# Altium schematic sheet Rectification filter.SchDoc
size A4
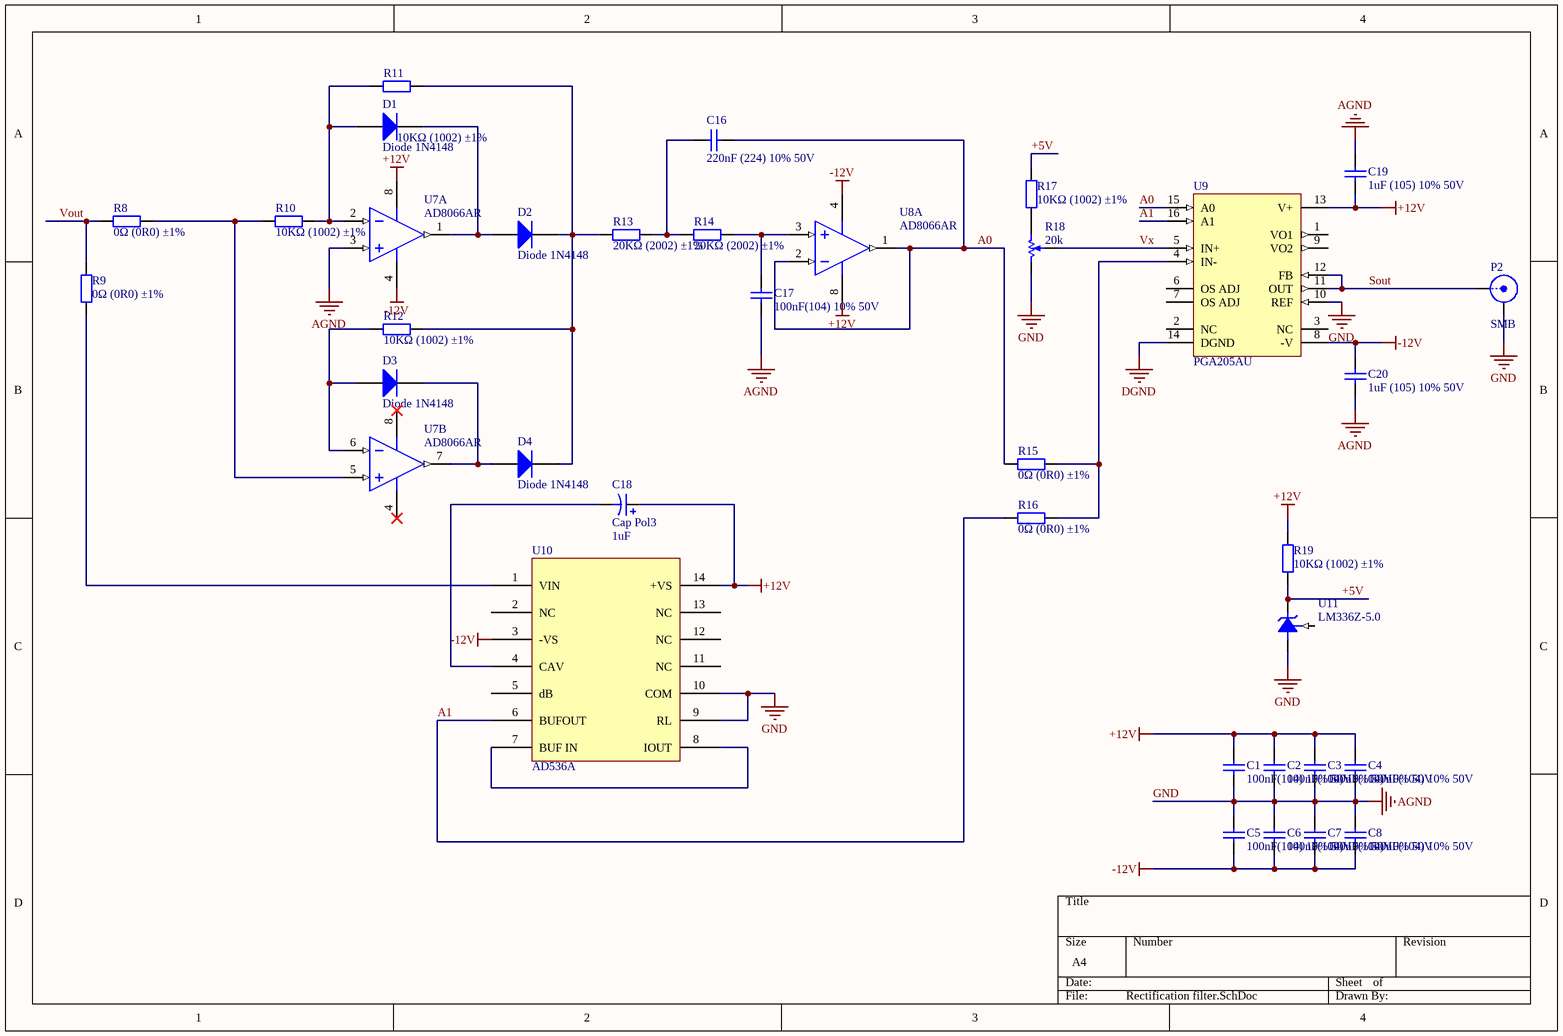
[diagram p0: Rectification filter.SchDoc]

## Parts
20k  R18  [POT4MM-2]
C1  100nF(104) 10% 50V  [LC-0805_C]
C2  100nF(104) 10% 50V  [LC-0805_C]
C3  100nF(104) 10% 50V  [LC-0805_C]
C4  100nF(104) 10% 50V  [LC-0805_C]
C5  100nF(104) 10% 50V  [LC-0805_C]
C6  100nF(104) 10% 50V  [LC-0805_C]
C7  100nF(104) 10% 50V  [LC-0805_C]
C8  100nF(104) 10% 50V  [LC-0805_C]
C16  220nF (224) 10% 50V  [LC-0805_C]
C17  100nF(104) 10% 50V  [LC-0805_C]
C18  Cap Pol3  value 1uF  [C0805]
C19  1uF (105) 10% 50V  [LC-0805_C]
C20  1uF (105) 10% 50V  [LC-0805_C]
D1  Diode 1N4148  [DO-35]
D2  Diode 1N4148  [DO-35]
D3  Diode 1N4148  [DO-35]
D4  Diode 1N4148  [DO-35]
P2  SMB  [SMB_V-RJ45]
R8  0Ω (0R0) ±1%  [LC-0805_R]
R9  0Ω (0R0) ±1%  [LC-0805_R]
R10  10KΩ (1002) ±1%  [LC-0805_R]
R11  10KΩ (1002) ±1%  [LC-0805_R]
R12  10KΩ (1002) ±1%  [LC-0805_R]
R13  20KΩ (2002) ±1%  [LC-0805_R]
R14  20KΩ (2002) ±1%  [LC-0805_R]
R15  0Ω (0R0) ±1%  [LC-0805_R]
R16  0Ω (0R0) ±1%  [LC-0805_R]
R17  10KΩ (1002) ±1%  [LC-0805_R]
R19  10KΩ (1002) ±1%  [LC-0805_R]
U7  AD8066AR  [ADI-R-8_N]  (parts A,B of 2)
U8  AD8066AR  [ADI-R-8_N]  (part A of 2)
U9  PGA205AU  [211F_N]
U10  AD536A
U11  LM336Z-5.0  [Z03A]

## Nets
+12V: C1.2 C2.2 C3.2 C4.2 C18.1 C19.1 R19.2 U7.8(+VS) U8.8(+VS) U9.13(V+) U10.14(+VS)
-12V: C5.1 C6.1 C7.1 C8.1 C20.2 U7.4(-VS) U8.4(-VS) U9.8(-V) U10.3(-VS)
DGND: U9.14(DGND)
GND: 20k.CW(+) C1.1 C2.1 C3.1 C4.1 C5.2 C6.2 C7.2 C8.2 C17.1 C19.2 C20.1 P2.2(Y) U7.3(+IN_1) U9.10(REF) U10.9(RL) U10.10(COM) U11.3(-V)  [also labelled AGND]
+5V: R17.2 R19.1 U11.2(+V)
A0: C16.2 R15.1 U8.1(VOUT_1) U8.2(-IN_1) U9.15(A0)
A1: R16.1 U9.16(A1) U10.6(BUFOUT)
Sout: P2.1(X) U9.11(OUT) U9.12(FB)
Vout: R8.1 R9.2
Vx: 20k.W U9.5(IN+)
Net20k_CCW: 20k.CCW(-) R17.1
NetC16_1: C16.1 R13.2 R14.1
NetC17_2: C17.2 R14.2 U8.3(+IN_1)
NetC18_2: C18.2 U10.4(CAV)
NetD1_1: D1.1(A) R10.2 R11.1 U7.2(-IN_1)
NetD1_2: D1.2(K) D2.1(A) U7.1(VOUT_1)
NetD2_2: D2.2(K) D4.2(K) R11.2 R12.2 R13.1
NetD3_1: D3.1(A) R12.1 U7.6(-IN_2)
NetD3_2: D3.2(K) D4.1(A) U7.7(VOUT_2)
NetR8_2: R8.2 R10.1 U7.5(+IN_2)
NetR9_1: R9.1 U10.1(VIN)
NetR15_2: R15.2 R16.2 U9.4(IN-)
NetU10_7: U10.7(BUF_IN) U10.8(IOUT)

Not connected (* = marked no-connect by the designer): U9 1(VO1) 2(NC) 3(NC) 6(OS_ADJ) 7(OS_ADJ) 9(VO2); U10 2(NC) 5(dB) 11(NC) 12(NC) 13(NC); U11 1(ADJ)

## Library data of the parts
20k = RPot SM: Square Trimming Potentiometer; Published: 17-Dec-2003; DatasheetVersion: Oct-2003; PackageReference: POT4MM-2; Publisher: Altium Limited; PackageDescription: Square Trimming Potentiometer; ComponentLink1Description: Manufacturer Link; ComponentLink1URL: http://bourns.com/2/search.html
C1-C8 C17 = 0805 100nF(104) 10% 50V: 贴片电容; ComponentLink1Description: 供应商链接; ComponentLink1URL: http://www.szlcsc.com/product/details_50686.html; Package: 0805; Supplier: LC; SuppliersPartNumber: C49678
C16 = 0805 220nF (224) 10% 50V: 贴片电容; ComponentLink1Description: 供应商链接; ComponentLink1URL: http://www.szlcsc.com/product/details_5810.html; Package: 0805; Supplier: LC; SuppliersPartNumber: C5378
C18 = Cap Pol3: Polarized Capacitor (Surface Mount); Published: 8-Jun-2000; LatestRevisionDate: 29-May-2009; LatestRevisionNote: IPC-7351 Footprint Added.; PackageReference: C0805; Publisher: Altium Limited; PackageDescription: Chip Capacitor
C19 C20 = 0805 1uF (105) 10% 50V: 贴片电容; ComponentLink1Description: 供应商链接; ComponentLink1URL: http://www.szlcsc.com/product/details_29074.html; Package: 0805; Supplier: LC; SuppliersPartNumber: C28323
D1-D4 = Diode 1N4148: High Conductance Fast Diode; Published: 8-Jun-2000; LatestRevisionDate: 17-Jul-2002; LatestRevisionNote: Re-released for DXP Platform.; DatasheetVersion: 1997; PackageReference: DO-35; Publisher: Altium Limited; PackageDescription: Diode, Axial; Body 3.8 x 1.9 mm (LxDia. max), Lead Dia. 0.53 mm (max); Code_JEDEC: DO-204-AH; ComponentLink1Description: Manufacturer Link; ComponentLink1URL: http://www.fairchildsemi.com/; ComponentLink2Description: Datasheet; ComponentLink2URL: http://www.fairchildsemi.com/ds/1N%2F1N4148.pdf
P2 = SMB: SMB Straight Connector; LatestRevisionDate: 17-Jul-2002; LatestRevisionNote: Re-released for DXP Platform.; Publisher: Altium Limited
R8 R9 R15 R16 = 0805 0Ω (0R0) 1%: 贴片电阻; ComponentLink1Description: 供应商链接; ComponentLink1URL: http://www.szlcsc.com/product/details_18165.html; Package: 0805; Supplier: LC; SuppliersPartNumber: C17477
R10-R12 R17 R19 = 0805 10KΩ (1002) 1%: 贴片电阻; ComponentLink1Description: 供应商链接; ComponentLink1URL: http://www.szlcsc.com/product/details_18102.html; Package: 0805; Supplier: LC; SuppliersPartNumber: C17414
R13 R14 = 0805 20KΩ (2002) 1%: 贴片电阻; ComponentLink1Description: 供应商链接; ComponentLink1URL: http://www.szlcsc.com/product/details_4735.html; Package: 0805; Supplier: LC; SuppliersPartNumber: C4328
U7 U8 = AD8066AR: Double Channel Low Power Operational Amplifier, 145 MHz BW, 180 V/us SR, Industrial, 8-pin SOIC (R-8), Tube; Generic Part Number: AD8066; Manufacturer: Analog Devices; Amplifiers Per Package: 2; Input Bias Current: 2pA; Input Offset Voltage: 400uV; Iq/Amp: 7.4mA; Small Signal Bandwidth: 145MHz; V Span Max: 24V; V Span Min: 5V; DatasheetVersion: Rev. J; PackageVersion: 060506-A; PackageReference: R-8; PackageDescription: 8-Pin Standard Small Outline Package, Body 3.9 x 4.9 mm, Pitch 1.27 mm; Supplier 1: Digi-Key; Supplier Part Number 1: AD8066AR-ND; Slew Rate: 180V/us; Mounting Technology: Surface Mount; Code_JEDEC: MS-012-AA; PartNumber: AD8066AR; ComponentLink1Description: Manufacturer URL; ComponentLink1URL: http://www.analog.com/en/index.html; ComponentLink2Description: Datasheet; ComponentLink2URL: http://www.analog.com/static/imported-files/data_sheets/AD8065_8066.pdf; ComponentLink3Description: Package Specification; ComponentLink3URL: http://www.analog.com/static/imported-files/packages/PKG_PDF/SOIC_Narrow%20(R)/R_8.pdf; ComponentLink4Description: Reference Circuit; ComponentLink4URL: http://www.analog.com/en/all-operational-amplifiers-op-amps/operational-amplifiers-op-amps/ad8066/products/product.html#product-recommendations
U9 = PGA205AU: Programmable Gain Instrumentation Amplifier; Note: Pins 2 and 3 are No internal Connection (NC) pins.; Published: 8-Jun-2000; LatestRevisionDate: 13-Apr-2006; LatestRevisionNote: IPC-7351 Footprint Added.; DatasheetVersion: Oct-1993; PackageReference: 211F; Publisher: Altium Limited; PackageDescription: 16-Pin Small Outline Integrated Circuit 1.27 mm Pitch; Code_JEDEC: MS-013-AA; Code_IPC: SOIC127P1030-16; ComponentLink1Description: Manufacturer Link; ComponentLink1URL: http://www.ti.com/; ComponentLink2Description: Datasheet; ComponentLink2URL: http://www-s.ti.com/sc/ds/PGA204.pdf
U11 = LM336Z-5.0: 5.0V Reference Diode, 3-pin TO-92; Manufacturer: National Semiconductor; PackageTopMarking: NSXYTT*LM336*Z-5.0; PowerWise: N; CompType: Voltage Reference IC; Published: 4-Dec-2008; LatestRevisionDate: 15-Jul-2009; LatestRevisionNote: Sch pins 1 & 3 reversed.; DatasheetVersion: Jun-2005; PackageVersion: revG, Sep-2000; PackageReference: Z03A; Publisher: Altium Limited; PackageDescription: TO-92, Molded, 3 Lead; Supplier 1: Farnell; Supplier Part Number 1: 9488502; PartNumber: LM336Z-5.0; RoHS: N; PinCount: 3; Code_JEDEC: TO-226-AA; ComponentLink1Description: LM136-5.0 Datasheet; ComponentLink1URL: http://www.national.com/ds/LM/LM136-5.0.pdf; ComponentLink2Description: LM136-5.0 Web Page; ComponentLink2URL: http://www.national.com/pf/LM/LM136-5.0.html; ComponentLink3Description: Z03A Package Page; ComponentLink3URL: http://www.national.com/packaging/folders/z03a.html